# Altium schematic sheet Quat.SchDoc
size A; SheetNumber: 1; SheetTotal: 1
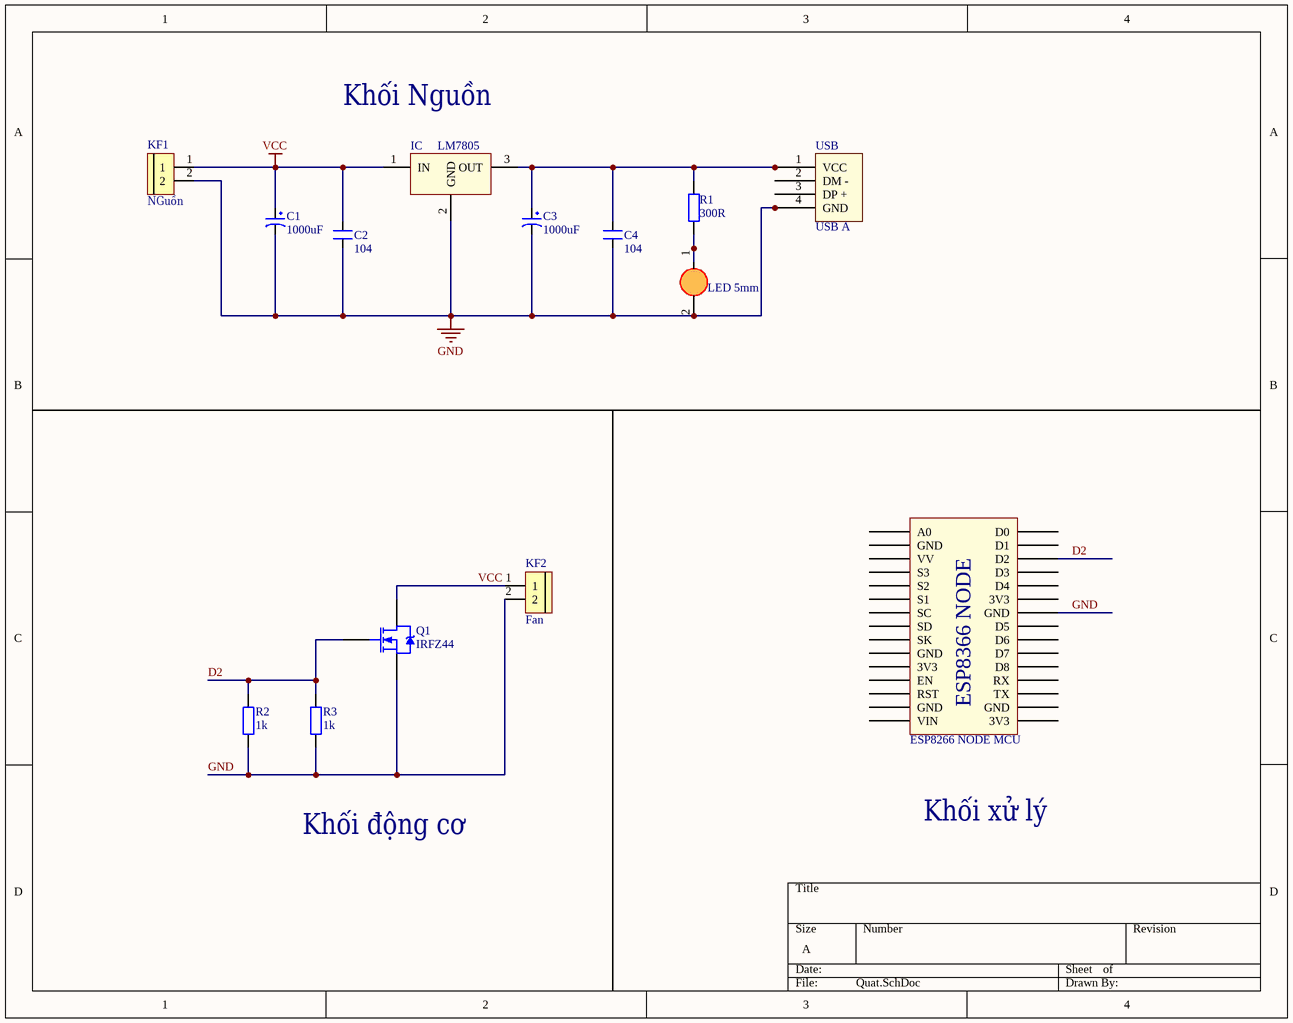
[diagram p0: Quat.SchDoc]

## Parts
*  ESP8266 NODE MCU  [ESP8266 NODE MCU]
C1  1000uF  [CAP secmi case A]
C2  104  [CN2]
C3  1000uF  [CAP secmi case A]
C4  104  [CN2]
IC  LM7805  [QTO-220]
KF1  NGuồn  [Con 2 KF301 5.08]
KF2  Fan  [Con 2 KF301 5.08]
LED1  LED 5mm  [LED5MM]
Q1  IRFZ44  [TO220]
R1  value 300R  [DIEN TRO 1/4 W]  (hidden comment: R0.4W)
R2  1k  [tro vach 1/2w]
R3  1k  [tro vach 1/2w]
USB  USB A  [USB A CN DIP]

## Nets
GND: *.24(GND) C1.2 C2.2 C3.2 C4.2 IC.2(GND) KF1.2 KF2.2 LED1.2(K) Q1.3(S) R2.2 R3.2 USB.4(GND)
VCC: C1.1 C2.1 IC.1(IN) KF1.1 KF2.1 Q1.2(D)
D2: *.28(D2) Q1.1(G) R2.1 R3.1
NetC3_1: C3.1 C4.1 IC.3(OUT) R1.1 USB.1(VCC)
NetLED1_1: LED1.1(A) R1.2

Not connected (* = marked no-connect by the designer): * 1(A0) 2(GND) 3(VV) 4(S3) 5(S2) 6(S1) 7(SC) 8(SD) 9(SK) 10(GND) 11(3V3) 12(EN) 13(RST) 14(GND) 15(VIN) 16(3V3) 17(GND) 18(TX) 19(RX) 20(D8) 21(D7) 22(D6) 23(D5) 25(3V3) 26(D4) 27(D3) 29(D1) 30(D0); USB 2(DM_-) 3(DP_+)

## Notes on the sheet
- Khối Nguồn
- Khối động cơ
- Khối xử lý
- (in symbol ESP8266 NODE MCU) ESP8366 NODE

## Library data of the parts
C1 C3 = tu secmi
C2 C4 = CN2: Cap np 104 => 105pF; Value: 0.1uF
IC = LM78xx: On ap +, from + 5 to + 24VDC; Value: LM7805
KF1 KF2 = CON 2 KF301: Cắm; Ma_Hang: MH000987; Ten_Linh_Kien: CON 2 KF301-2P 5.08MM Xanh Dương; Don_Vi: Con; Chung_Loai: Cắm; Ghi_Chu: *; Kieu_Chan: *
Q1 = FET IRFZ44 DIP: TO-220
R1 = Res 1/4 W: Resistor; Published: 8-Jun-2000; LatestRevisionDate: 17-Jul-2002; LatestRevisionNote: Re-released for DXP Platform.; PackageReference: AXIAL-0.4; Publisher: Altium Limited
R2 R3 = Tro Vach 1/2W 5% 1k: Cắm; Don_Vi: Con; So_Chan: 2; Ten_Linh_Kien: Trở 5% 1/2w 1K; Ma_Hang: MH007240; Chung_Loai: Cắm; Kieu_Chan: *
USB = USB A CN DIP: USB Type A; Ten: USB A Cái DIP; Ma_Hang: MH000941